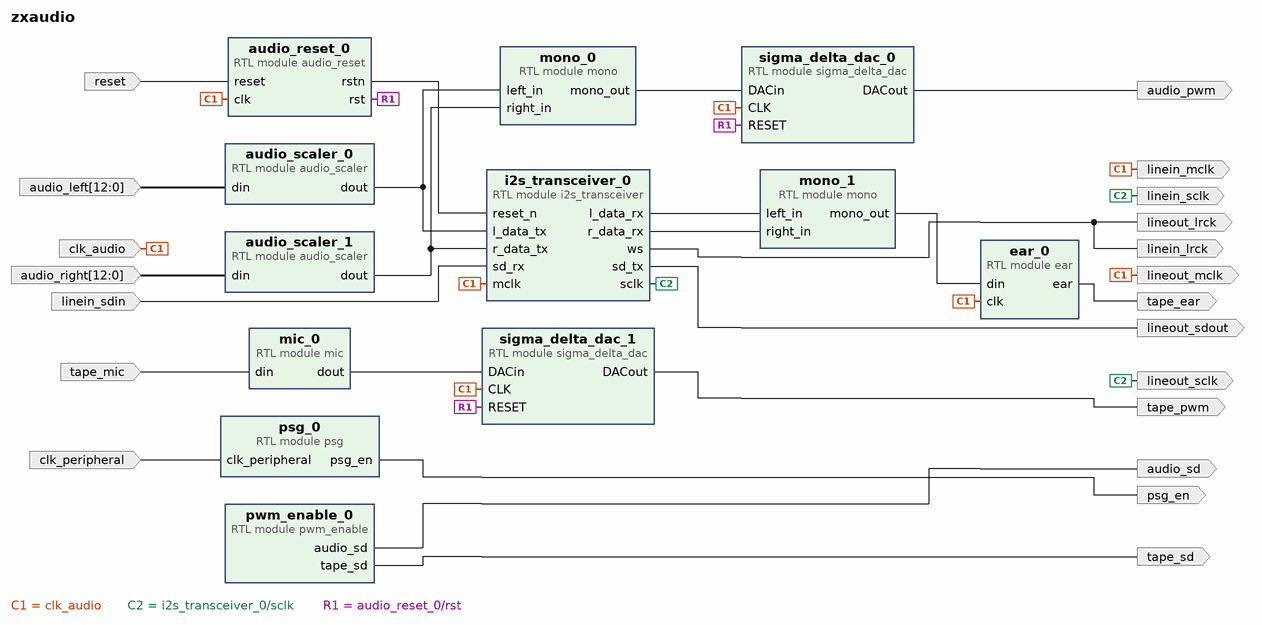
[diagram p0: block diagram of the top level]
# Vivado block design zxaudio, xc7a100tcsg324-1, Vivado 2021.2
create_bd_design zxaudio

create_bd_port -dir O -type clk lineout_mclk
create_bd_port -dir O -type clk lineout_lrck
create_bd_port -dir O -type clk lineout_sclk
create_bd_port -dir O -type clk linein_mclk
create_bd_port -dir O -type clk linein_sclk
create_bd_port -dir O -type clk linein_lrck
create_bd_port -dir O -type data lineout_sdout
create_bd_port -dir I -type data linein_sdin
create_bd_port -dir I -type data tape_mic
create_bd_port -dir O -type data tape_ear
create_bd_port -dir O audio_pwm
create_bd_port -dir O tape_pwm
create_bd_port -dir O -type ce psg_en
create_bd_port -dir I -from 12 -to 0 -type data audio_left
create_bd_port -dir I -from 12 -to 0 audio_right
create_bd_port -dir I -type rst reset
set_property -dict {CONFIG.POLARITY ACTIVE_HIGH} [get_bd_ports reset]
create_bd_port -dir I -type clk clk_peripheral
set_property -dict {CONFIG.FREQ_HZ 28000000} [get_bd_ports clk_peripheral]
create_bd_port -dir O audio_sd
create_bd_port -dir O tape_sd
create_bd_port -dir I -type clk clk_audio
set_property -dict {CONFIG.FREQ_HZ 22580650} [get_bd_ports clk_audio]

create_bd_cell -type module -reference sigma_delta_dac sigma_delta_dac_0
set_property -dict {CONFIG.MSBI 15} [get_bd_cells sigma_delta_dac_0]
create_bd_cell -type module -reference sigma_delta_dac sigma_delta_dac_1
set_property -dict {CONFIG.MSBI 15} [get_bd_cells sigma_delta_dac_1]
create_bd_cell -type module -reference i2s_transceiver i2s_transceiver_0
set_property -dict {CONFIG.d_width 16 CONFIG.mclk_sclk_ratio 8} [get_bd_cells i2s_transceiver_0]
create_bd_cell -type module -reference ear ear_0
create_bd_cell -type module -reference mic mic_0
create_bd_cell -type module -reference mono mono_0
create_bd_cell -type module -reference mono mono_1
create_bd_cell -type module -reference psg psg_0
create_bd_cell -type module -reference pwm_enable pwm_enable_0
create_bd_cell -type module -reference audio_scaler audio_scaler_0
create_bd_cell -type module -reference audio_scaler audio_scaler_1
create_bd_cell -type module -reference audio_reset audio_reset_0

# ---- connections ----

connect_bd_net -net DC_blocker_0_dout [get_bd_pins audio_scaler_0/dout] [get_bd_pins i2s_transceiver_0/l_data_tx] [get_bd_pins mono_0/left_in]
connect_bd_net -net DC_blocker_1_dout [get_bd_pins audio_scaler_1/dout] [get_bd_pins i2s_transceiver_0/r_data_tx] [get_bd_pins mono_0/right_in]
connect_bd_net [get_bd_ports audio_left] [get_bd_pins audio_scaler_0/din]
connect_bd_net [get_bd_pins audio_reset_0/rstn] [get_bd_pins i2s_transceiver_0/reset_n]
connect_bd_net [get_bd_ports audio_right] [get_bd_pins audio_scaler_1/din]
connect_bd_net -net clk_peripheral_1 [get_bd_ports clk_audio] \
  [get_bd_ports lineout_mclk] [get_bd_ports linein_mclk] [get_bd_pins sigma_delta_dac_0/CLK] \
  [get_bd_pins sigma_delta_dac_1/CLK] [get_bd_pins i2s_transceiver_0/mclk] [get_bd_pins ear_0/clk] \
  [get_bd_pins audio_reset_0/clk]
connect_bd_net [get_bd_ports clk_peripheral] [get_bd_pins psg_0/clk_peripheral]
connect_bd_net [get_bd_pins ear_0/ear] [get_bd_ports tape_ear]
connect_bd_net [get_bd_pins i2s_transceiver_0/l_data_rx] [get_bd_pins mono_1/left_in]
connect_bd_net [get_bd_pins i2s_transceiver_0/r_data_rx] [get_bd_pins mono_1/right_in]
connect_bd_net [get_bd_pins i2s_transceiver_0/sclk] [get_bd_ports lineout_sclk] [get_bd_ports linein_sclk]
connect_bd_net [get_bd_pins i2s_transceiver_0/sd_tx] [get_bd_ports lineout_sdout]
connect_bd_net [get_bd_pins i2s_transceiver_0/ws] [get_bd_ports lineout_lrck] [get_bd_ports linein_lrck]
connect_bd_net [get_bd_ports linein_sdin] [get_bd_pins i2s_transceiver_0/sd_rx]
connect_bd_net [get_bd_pins mic_0/dout] [get_bd_pins sigma_delta_dac_1/DACin]
connect_bd_net -net mic_1 [get_bd_ports tape_mic] [get_bd_pins mic_0/din]
connect_bd_net [get_bd_pins mono_0/mono_out] [get_bd_pins sigma_delta_dac_0/DACin]
connect_bd_net -net mono_2_mono_out [get_bd_pins mono_1/mono_out] [get_bd_pins ear_0/din]
connect_bd_net [get_bd_pins psg_0/psg_en] [get_bd_ports psg_en]
connect_bd_net [get_bd_pins pwm_enable_0/audio_sd] [get_bd_ports audio_sd]
connect_bd_net [get_bd_pins pwm_enable_0/tape_sd] [get_bd_ports tape_sd]
connect_bd_net -net reset_1 [get_bd_pins audio_reset_0/rst] [get_bd_pins sigma_delta_dac_0/RESET] [get_bd_pins sigma_delta_dac_1/RESET]
connect_bd_net [get_bd_ports reset] [get_bd_pins audio_reset_0/reset]
connect_bd_net [get_bd_pins sigma_delta_dac_0/DACout] [get_bd_ports audio_pwm]
connect_bd_net [get_bd_pins sigma_delta_dac_1/DACout] [get_bd_ports tape_pwm]

validate_bd_design
save_bd_design
